# Altium schematic sheet POWER.SchDoc
size 594 x 419 mm
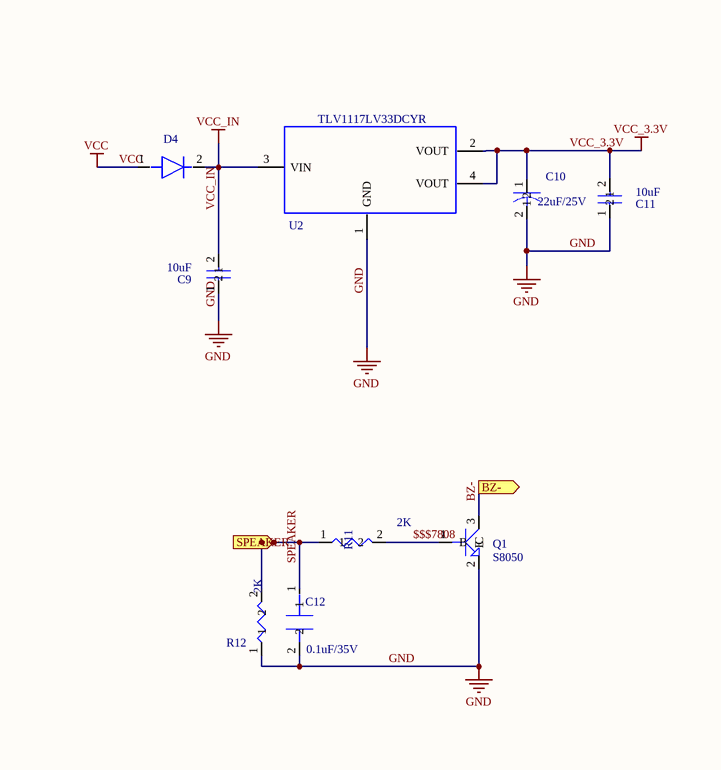
[diagram p0: POWER.SchDoc, top left]
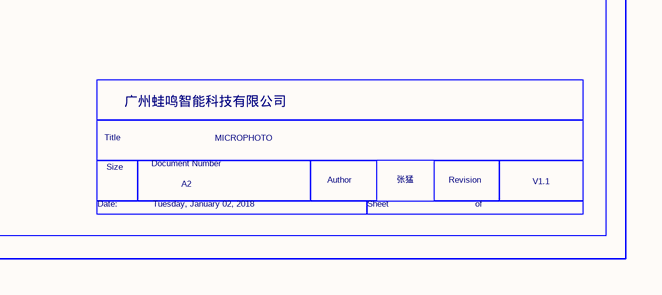
[diagram p1: POWER.SchDoc, bottom right]

## Parts
C9  value 10uF  (hidden comment: EC0603)
C10  value 22uF/25V  (hidden comment: EC1206)
C11  value 10uF  (hidden comment: EC0603)
C12  value 0.1uF/35V  (hidden comment: CAP)
D4  DIODE  (value not drawn)
Q1  S8050
R11  value 2K  (hidden comment: ER0402)
R12  value 2K  (hidden comment: ER0402)
U2  TLV1117LV33DCYR

## Ports
BZ-, SPEAKER

## Nets
GND: C9.1 C10.2 C11.1 C12.2 Q1.2(E) R12.1 U2.1(GND)
VCC: D4.1
VCC_3.3V: C10.1 C11.2 U2.2(VOUT) U2.4(VOUT)
VCC_IN: C9.2 D4.2 U2.3(VIN)
$$$7808: Q1.1(B) R11.2
BZ-: Q1.3(C) ; port BZ-
SPEAKER: C12.1 R11.1 R12.2 ; port SPEAKER

## Notes on the sheet
- 广州蛙鸣智能科技有限公司
- Title
- Size
- Document Number
- MICROPHOTO
- Date:
- Tuesday, January 02, 2018
- A2
- Author
- Sheet
- 张猛
- Revision
- of
- V1.1

## Library data of the parts
C9 C11 = EC0603: PCB DECAL: C0603; PAGE: 1; Source_Path: E:\LIB\LIBRARY1.OLB
C10 = EC1206: ALU CAP 100UF 10V 20%   DC-5X7MM; Source_Path: E:\LIB\LIBRARY1.OLB; PCB DECAL: EC1206
C12 = CAP: Source_Path: E:\PROJECT\BGA441\MAINCHIP_DDR2_DDR3_V1.0.DSN; PAGE: 2; PCB DECAL: C0603
D4 = DIODE: GENERIC DIODE W ALTERNATE; ROOM: LCD-AVDD; Value: SS24; Source_Path: D:\DROPBOX\ORCAD LIBRARY\ROCK-CHIPS.OLB; Sim.Analog.Model: d1n914; Sim.Analog.Order: Model$; Sim.Analog.Prefix: D; PCB DECAL: SMA
Q1 = S8050: Source_Path: D:\DROPBOX\ORCAD LIBRARY\ROCK-CHIPS.OLB; PCB DECAL: SOT23; Value: S8050
R11 R12 = ER0402: Source_Path: D:\ORCAD LIB\LIB_E1A.OLB; PCB DECAL: ER0603
U2 = TLV1117LV33DCYR: PCB DECAL: SOT223; Value: TLV1117LV33DCYR